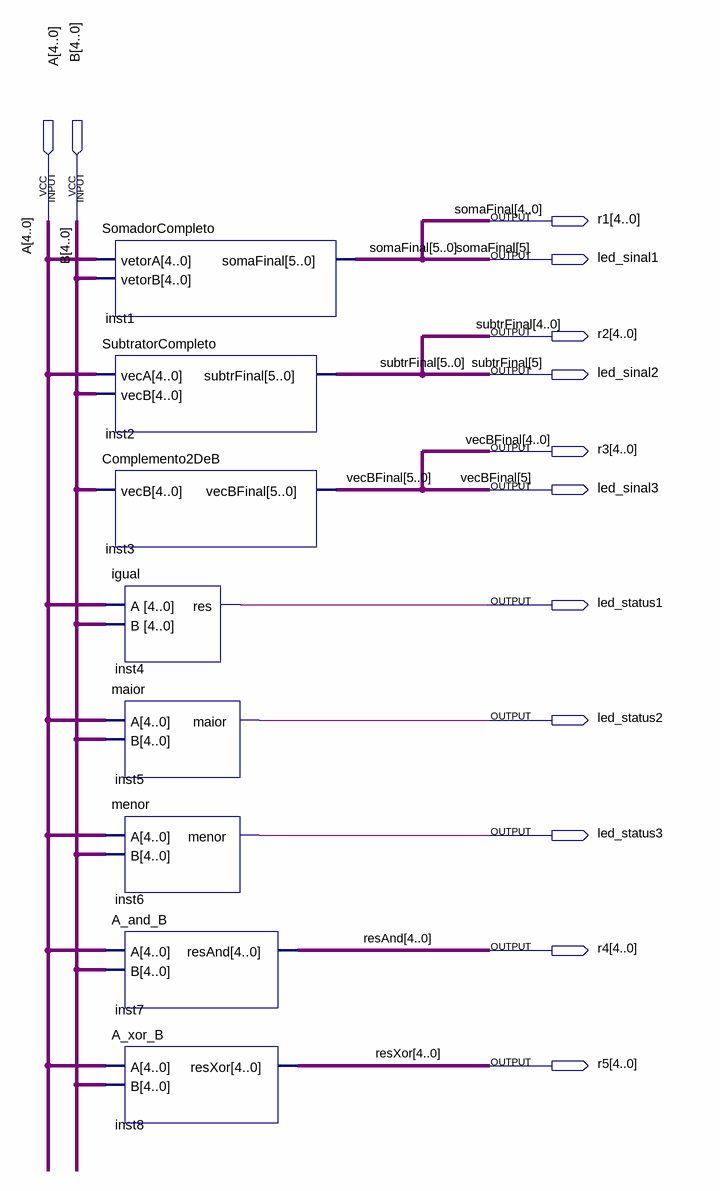
[diagram p0: schematic sheet]
// Quartus schematic projBase.bdf as structural Verilog: 8 symbols, 13 pins
module projBase (
  input  [4:0] A,
  input  [4:0] B,
  output [4:0] r1,
  output led_sinal1,
  output [4:0] r2,
  output led_sinal2,
  output [4:0] r3,
  output led_sinal3,
  output led_status1,
  output led_status2,
  output led_status3,
  output [4:0] r4,
  output [4:0] r5
);

  SomadorCompleto inst1 (.vetorA(A), .vetorB(B), .somaFinal({led_sinal1, r1}));
  SubtratorCompleto inst2 (.vecA(A), .vecB(B), .subtrFinal({led_sinal2, r2}));
  Complemento2DeB inst3 (.vecB(B), .vecBFinal({led_sinal3, r3}));
  igual inst4 (.A(A), .B(B), .res(led_status1));
  maior inst5 (.A(A), .B(B), .maior(led_status2));
  menor inst6 (.A(A), .B(B), .menor(led_status3));
  A_and_B inst7 (.A(A), .B(B), .resAnd(r4));
  A_xor_B inst8 (.A(A), .B(B), .resXor(r5));

  // Other names for the same wires on the sheet: resAnd[4:0] = r4; resXor[4:0] = r5;
  //   somaFinal[5:0] = {led_sinal1, r1}; subtrFinal[5:0] = {led_sinal2, r2}; vecBFinal[5:0] = {led_sinal3, r3}
endmodule
